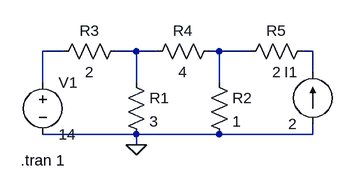
[diagram p0: schematic Q4.asc]
Q4.asc, the LTspice schematic file:
Version 4
SHEET 1 880 680
WIRE 112 -336 80 -336
WIRE 224 -336 192 -336
WIRE 256 -336 224 -336
WIRE 352 -336 336 -336
WIRE 400 -336 352 -336
WIRE 496 -336 480 -336
WIRE 496 -304 496 -336
WIRE 80 -288 80 -336
WIRE 224 -288 224 -336
WIRE 352 -288 352 -336
WIRE 224 -208 80 -208
WIRE 352 -208 224 -208
WIRE 496 -208 496 -224
WIRE 496 -208 352 -208
WIRE 224 -192 224 -208
FLAG 224 -192 0
SYMBOL voltage 80 -304 R0
WINDOW 123 0 0 Left 0
WINDOW 39 0 0 Left 0
SYMATTR InstName V1
SYMATTR Value 14
SYMBOL res 208 -304 R0
SYMATTR InstName R1
SYMATTR Value 3
SYMBOL res 336 -304 R0
SYMATTR InstName R2
SYMATTR Value 1
SYMBOL res 208 -352 R90
WINDOW 0 0 56 VBottom 2
WINDOW 3 32 56 VTop 2
SYMATTR InstName R3
SYMATTR Value 2
SYMBOL res 352 -352 R90
WINDOW 0 0 56 VBottom 2
WINDOW 3 32 56 VTop 2
SYMATTR InstName R4
SYMATTR Value 4
SYMBOL res 496 -352 R90
WINDOW 0 0 56 VBottom 2
WINDOW 3 32 56 VTop 2
SYMATTR InstName R5
SYMATTR Value 2
SYMBOL current 496 -224 R180
WINDOW 0 24 80 Left 2
WINDOW 3 24 0 Left 2
WINDOW 123 0 0 Left 0
WINDOW 39 0 0 Left 0
SYMATTR InstName I1
SYMATTR Value 2
TEXT 46 -168 Left 2 !.tran 1

The netlist it stands for:
* Q4.asc
V1 N001 0 14
R1 N002 0 3
R2 N003 0 1
R3 N002 N001 2
R4 N003 N002 4
R5 N004 N003 2
I1 0 N004 2
.tran 1
.backanno
.end